# Altium project UCLA-DRS4.PrjPCB
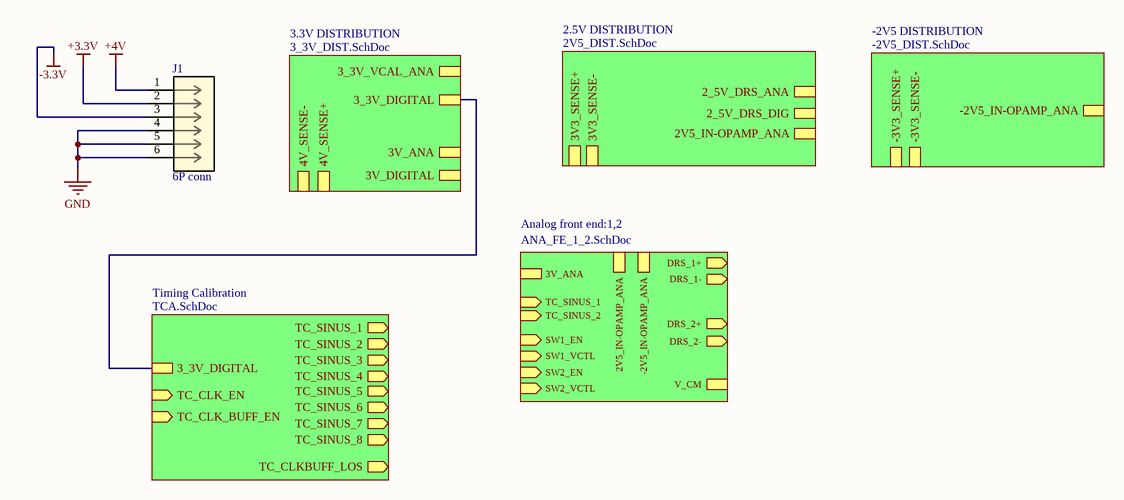
[diagram p0: DRS4-TOP.SchDoc]
6 sheets, 218 parts. Net scope: hierarchical (ports join the sheet entries above them; power ports are global).
Board file: DRS4-PCB.PcbDoc
Sheets:
  DRS4-TOP.SchDoc
    3.3V DISTRIBUTION = 3_3V_DIST.SchDoc
    2.5V DISTRIBUTION = 2V5_DIST.SchDoc
    -2V5 DISTRIBUTION = -2V5_DIST.SchDoc
    Timing Calibration = TCA.SchDoc
    Analog front end:1,2 = ANA_FE_1_2.SchDoc

## Sheet DRS4-TOP.SchDoc: UCLA-DRS4
size Letter; Organization: University of California; Address1: 475 Portola Plaza; Address2: Los Angeles, CA 90095; Revision: R01; SheetNumber: 1; SheetTotal: 1

### Parts
J1  6P conn  [CONN_1586041-6_T]

### Sub-sheets
2.5V DISTRIBUTION = 2V5_DIST.SchDoc: 2_5V_DRS_ANA, 2_5V_DRS_DIG, 3V3_SENSE+, 3V3_SENSE-, 2V5_IN-OPAMP_ANA
3.3V DISTRIBUTION = 3_3V_DIST.SchDoc: 4V_SENSE+, 4V_SENSE-, 3_3V_VCAL_ANA, 3_3V_DIGITAL, 3V_ANA, 3V_DIGITAL
-2V5 DISTRIBUTION = -2V5_DIST.SchDoc: -3V3_SENSE+, -3V3_SENSE-, -2V5_IN-OPAMP_ANA
Analog front end:1,2 = ANA_FE_1_2.SchDoc: SW1_VCTL (in), TC_SINUS_1 (in), TC_SINUS_2 (in), 3V_ANA, SW1_EN (in), 2V5_IN-OPAMP_ANA, -2V5_IN-OPAMP_ANA, DRS_1+ (out), DRS_2+ (out), DRS_1- (out), DRS_2- (out), V_CM, SW2_EN (in), SW2_VCTL (in)
Timing Calibration = TCA.SchDoc: 3_3V_DIGITAL, TC_CLK_EN (in), TC_CLKBUFF_LOS (out), TC_CLK_BUFF_EN (in), TC_SINUS_1 (out), TC_SINUS_2 (out), TC_SINUS_3 (out), TC_SINUS_4 (out), TC_SINUS_5 (out), TC_SINUS_6 (out), TC_SINUS_7 (out), TC_SINUS_8 (out)

### Nets
+3.3V: J1.2
+4V: J1.1
-3.3V: J1.3
GND: J1.4 J1.5 J1.6
NetC6_2: sheet 3.3V DISTRIBUTION/3_3V_DIGITAL, sheet Timing Calibration/3_3V_DIGITAL

### Notes on the sheet
- 475 Portola Plaza
- GAPS TOF
- Title
- igarcia91@g.ucla.edu
- Los Angeles, CA
- 310-825-0344
- Size:
- Date:
- Letter
- Number:
- Time:
- Sheet
- Revision:
- of
- andrew.peck@cern.ch
- spq@ucla.edu
- File:

### Library data of the parts
J1 = 1586041-6: Headers & Wire Housings RA HDR W/O PEGS 6P; Vendor: TE Connectivity; Built_By: EMA_UL_Team; C: Copyright (C) 2015 Accelerated Designs. All rights reserved; Manufacturer_Part_Number: 1586041-6; Copyright: Copyright (C) 2016 Accelerated Designs. All rights reserved; RefDes: RefDes; Type: DEV; Value: Value

## Sheet 3_3V_DIST.SchDoc: 3.3V Distribution
size Letter; Organization: University of California; Address1: 475 Portola Plaza; Address2: Los Angeles, CA 90095; Revision: R01; SheetNumber: 1; SheetTotal: 1
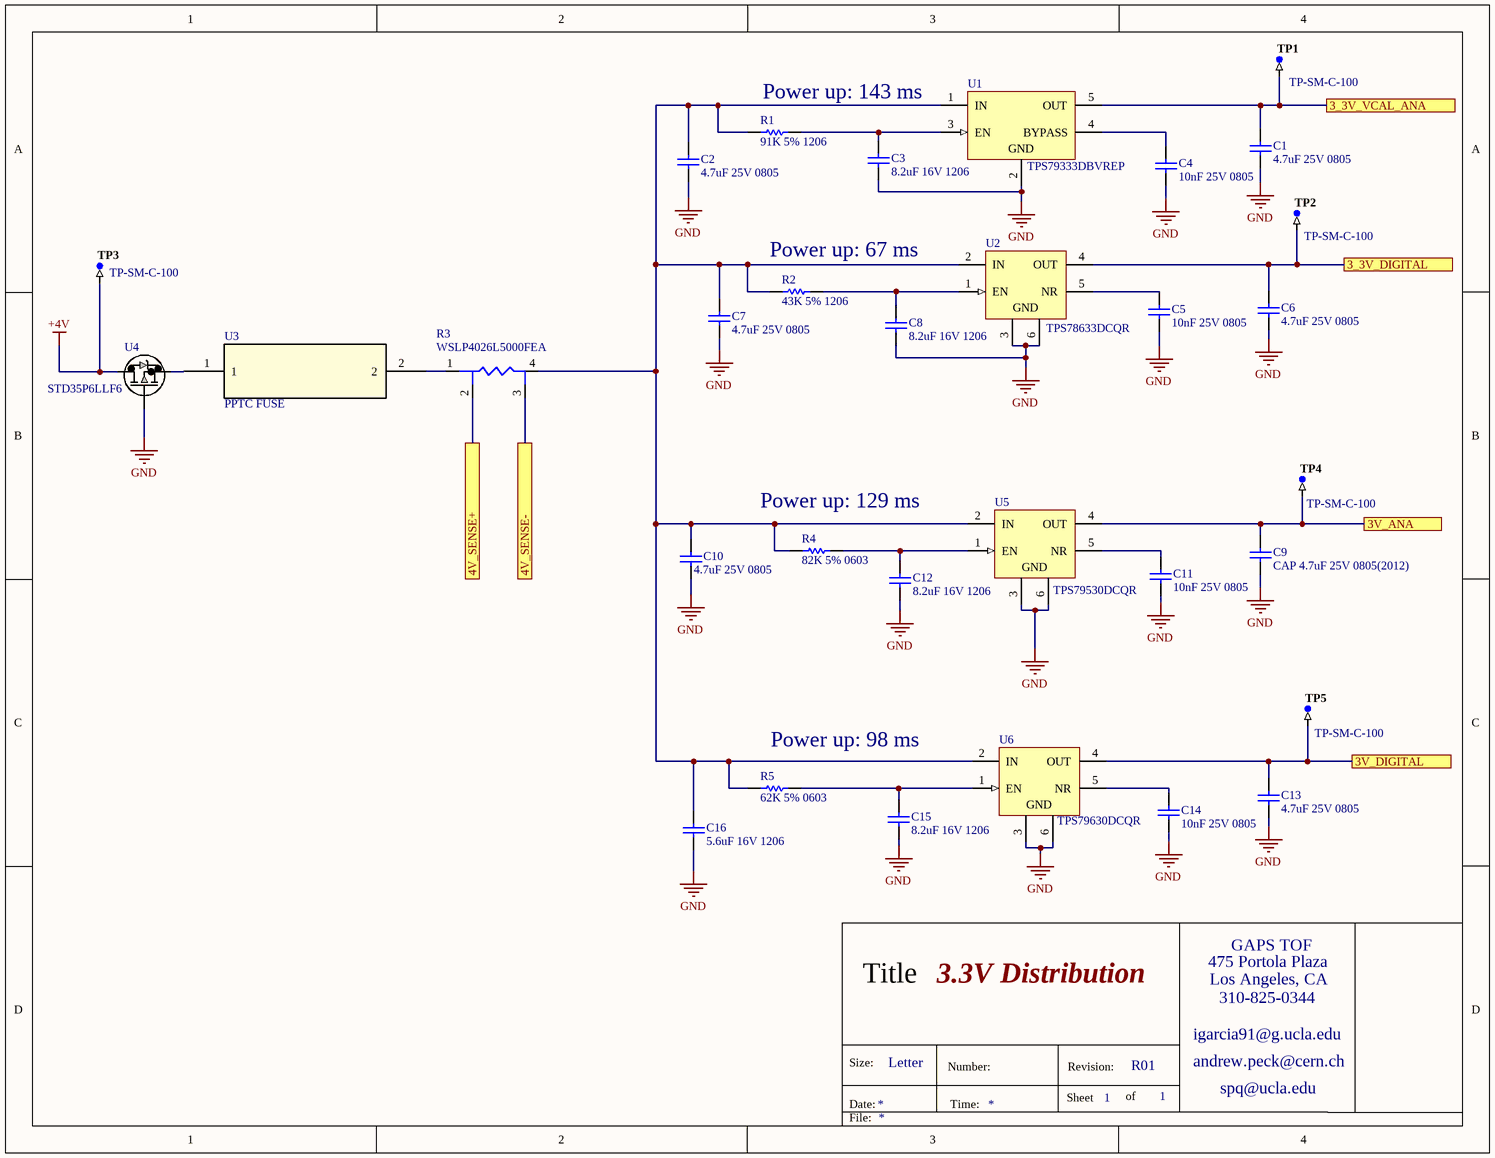
[diagram p1: 3_3V_DIST.SchDoc]

### Parts
C1  4.7uF 25V 0805  [CAPC0805(2012)145_L]
C2  4.7uF 25V 0805  [CAPC0805(2012)145_L]
C3  8.2uF 16V 1206  [CAPC1206(3216)190_N]
C4  10nF 25V 0805  [CAPC0805(2012)145_M]
C5  10nF 25V 0805  [CAPC0805(2012)145_M]
C6  4.7uF 25V 0805  [CAPC0805(2012)145_L]
C7  4.7uF 25V 0805  [CAPC0805(2012)145_L]
C8  8.2uF 16V 1206  [CAPC1206(3216)190_N]
C9  CAP 4.7uF 25V 0805(2012)  [CAPC0805(2012)145_L]
C10  4.7uF 25V 0805  [CAPC0805(2012)145_L]
C11  10nF 25V 0805  [CAPC0805(2012)145_M]
C12  8.2uF 16V 1206  [CAPC1206(3216)190_N]
C13  4.7uF 25V 0805  [CAPC0805(2012)145_L]
C14  10nF 25V 0805  [CAPC0805(2012)145_M]
C15  8.2uF 16V 1206  [CAPC1206(3216)190_N]
C16  5.6uF 16V 1206  [CAPC1206(3216)190_N]
R1  91K 5% 1206  [RESC1206(3216)_M]
R2  43K 5% 1206  [RESC1206(3216)_N]
R3  WSLP4026L5000FEA
R4  82K 5% 0603  [RESC0603(1608)_M]
R5  62K 5% 0603  [RESC0603(1608)_L]
TP1  TP-SM-C-100  [TP-SM-C-100]  (no BOM)
TP2  TP-SM-C-100  [TP-SM-C-100]  (no BOM)
TP3  TP-SM-C-100  [TP-SM-C-100]  (no BOM)
TP4  TP-SM-C-100  [TP-SM-C-100]  (no BOM)
TP5  TP-SM-C-100  [TP-SM-C-100]  (no BOM)
U1  TPS79333DBVREP  [DBV0005A_M]
U2  TPS78633DCQR  [DCQ0006A_L]
U3  PPTC FUSE  [0ZCF]
U4  STD35P6LLF6  [DPAK]
U5  TPS79530DCQR  [DCQ0006A_L]
U6  TPS79630DCQR  [DCQ0006A_L]

### Ports
3_3V_DIGITAL, 3_3V_VCAL_ANA, 3V_ANA, 3V_DIGITAL, 4V_SENSE+, 4V_SENSE-

### Nets
+4V: TP3.1 U4.2(D)
GND: C1.1 C2.1 C3.1 C4.1 C5.1 C6.1 C7.1 C8.1 C9.1 C10.1 C11.1 C12.1 C13.1 C14.1 C15.1 C16.1 U1.2(GND) U2.3(GND) U2.6(GND) U4.1(G) U5.3(GND) U5.6(GND) U6.3(GND) U6.6(GND)
NetC1_2: C1.2 TP1.1 U1.5(OUT) ; port 3_3V_VCAL_ANA
NetC2_2: C2.2 C7.2 C10.2 C16.2 R1.1 R2.1 R3.4 R4.1 R5.1 U1.1(IN) U2.2(IN) U5.2(IN) U6.2(IN)
NetC3_2: C3.2 R1.2 U1.3(EN)
NetC4_2: C4.2 U1.4(BYPASS)
NetC5_2: C5.2 U2.5(NR)
NetC6_2: C6.2 TP2.1 U2.4(OUT) ; port 3_3V_DIGITAL
NetC8_2: C8.2 R2.2 U2.1(EN)
NetC9_2: C9.2 TP4.1 U5.4(OUT) ; port 3V_ANA
NetC11_2: C11.2 U5.5(NR)
NetC12_2: C12.2 R4.2 U5.1(EN)
NetC13_2: C13.2 TP5.1 U6.4(OUT) ; port 3V_DIGITAL
NetC14_2: C14.2 U6.5(NR)
NetC15_2: C15.2 R5.2 U6.1(EN)
NetR3_1: R3.1 U3.2
NetR3_2: R3.2 ; port 4V_SENSE+
NetR3_3: R3.3 ; port 4V_SENSE-
NetU3_1: U3.1 U4.3(S)

### Notes on the sheet
- Power up: 143 ms
- (near R2) Power up: 67 ms
- (near R4) Power up: 129 ms
- (near R5) Power up: 98 ms
- 475 Portola Plaza
- GAPS TOF
- Title
- igarcia91@g.ucla.edu
- Los Angeles, CA
- 310-825-0344
- Size:
- Date:
- Letter
- Number:
- Time:
- Sheet
- Revision:
- of
- andrew.peck@cern.ch
- spq@ucla.edu
- File:

### Library data of the parts
C1 C2 C6 C7 C9 C10 C13 = CMP-1036-04895-1: CAP 4.7uF 25V ±10% 0805 (2012 Metric) Thickness 1.45mm SMD; Case-Metric: 2012; Case-EIA: 0805; Tolerance: Â±10%; Value: 4.7uF; Technology: SMT; Rated Voltage: 25 V; Max Thickness: 1.45 mm
C3 C8 C12 C15 = CMP-1037-04959-1: CAP 8.2uF 16V ±20% 1206 (3216 Metric) Thickness 1.9mm SMD; Case-EIA: 1206; Case-Metric: 3216; Tolerance: Â±20%; Technology: SMT; Max Thickness: 1.9 mm; Value: 8.2uF; Rated Voltage: 16 V
C4 C5 C11 C14 = CMP-1036-03831-1: CAP 10nF 25V ±10% 0805 (2012 Metric) Thickness 1.45mm SMD; Case-EIA: 0805; Case-Metric: 2012; Tolerance: Â±10%; Value: 10nF; Max Thickness: 1.45 mm; Technology: SMT; Rated Voltage: 25 V
C16 = CMP-1037-04932-1: CAP 5.6uF 16V ±10% 1206 (3216 Metric) Thickness 1.9mm SMD; Tolerance: Â±10%; Case-Metric: 3216; Case-EIA: 1206; Technology: SMT; Rated Voltage: 16 V; Value: 5.6uF; Max Thickness: 1.9 mm
R1 = CMP-1014-00121-1: 91K 0.25W 5% 1206 (3216 Metric)  SMD; Value: 91000.00 Ohm; Case-Metric: 3216; Case-EIA: 1206; Tolerance: 5 %; Power: 0.25 W; Technology: SMT
R2 = CMP-1014-00113-1: 43K 0.25W 5% 1206 (3216 Metric)  SMD; Case-EIA: 1206; Case-Metric: 3216; Value: 43000.00 Ohm; Tolerance: 5 %; Technology: SMT; Power: 0.25 W
R3 = WSLP4026L5000FEA: Current Sense Resistors - SMD 7watt .0005ohm 1%
R4 = CMP-1012-00120-1: 82K 0.1W 5% 0603 (1608 Metric)  SMD; Case-Metric: 1608; Case-EIA: 0603; Value: 82000.00 Ohm; Technology: SMT; Tolerance: 5 %; Power: 0.1 W
R5 = CMP-1012-00117-1: 62K 0.1W 5% 0603 (1608 Metric)  SMD; Value: 62000.00 Ohm; Case-Metric: 1608; Case-EIA: 0603; Technology: SMT; Power: 0.1 W; Tolerance: 5 %
TP1-TP5 = CMP-0484-00002-2: Test Point, Surface Mount, Circular, Pad Diameter 1 mm; Manufacturer: No Vendor; PartNumber: TP-SM-C-100
U1 = CMP-0394-00316-2: Single Output Fast RF LDO, 200 mA, Fixed 3.3 V Output, 2.7 to 5.5 V Input, 5-pin SOT-23 (DBV), -40 to 125 degC, Green (RoHS & no Sb/Br); Manufacturer: Texas Instruments; Accuracy(%): 2; SubFamily: Single Channel LDO; Vin(Max)(V): 5.5; Fixed Output Options(V): 3.3; Vdo(Typ)(mV): 102; Iout(Max)(A): 0.2; Rating: HiRel Enhanced Product; Vin(Min)(V): 2.7; DatasheetVersion: SGLS163B; PackageVersion: 4073253-4/K; Code_JEDEC: MO-178; PackageDescription: 5-Pin Plastic Small Outline, Body 1.60 Ãƒâ€” 2.90 mm, Pitch 0.95 mm; ComponentLink1Description: Manufacturer URL; ComponentLink1URL: http://www.ti.com/; ComponentLink2Description: Datasheet; ComponentLink2URL: http://www.ti.com/general/docs/lit/getliterature.tsp?genericPartNumber=TPS79333-EP&fileType=pdf; ComponentLink3URL: http://www.ti.com/litv/pdf/mpds018i; Mounting Technology: Surface Mount; PartNumber: TPS79333DBVREP; Vout Adj(Min)(V): 3.3; PackageReference: DBV0005A; Iq(Typ)(mA): 0.2; Vout Adj(Max)(V): 3.3; Eco-Plan: Green (RoHS & no Sb/Br); ComponentLink3Description: Package Specification
U2 = CMP-0395-00353-2: Single Output High PSRR LDO, 1.5 A, Fixed 3.3 V Output, 2.7 to 5.5 V Input, 6-pin SOT-223 (DCQ), -40 to 125 degC, Green (RoHS & no Sb/Br); Manufacturer: Texas Instruments; Vdo(Typ)(mV): 340; Iq(Typ)(mA): 0.02; Fixed Output Options(V): 3.3; Iout(Max)(A): 1.5; Accuracy(%): 3; SubFamily: Single Channel LDO; Vin(Max)(V): 5.5; Vin(Min)(V): 2.7; ComponentLink2URL: http://www.ti.com/general/docs/lit/getliterature.tsp?genericPartNumber=TPS78633&fileType=pdf; PackageDescription: 6-Pin Plastic Small Outline, Body 3.5 x 6.5 mm, Pitch 1.27 mm; Eco-Plan: Green (RoHS & no Sb/Br); ComponentLink2Description: Datasheet; ComponentLink1URL: http://www.ti.com/; Mounting Technology: Surface Mount; Vout Adj(Min)(V): 3.3; ComponentLink1Description: Manufacturer URL; PackageReference: DCQ0006A; ComponentLink3URL: http://www.ti.com/litv/pdf/mpds098c; PackageVersion: 4202109/D; ComponentLink3Description: Package Specification; PartNumber: TPS78633DCQR; Vout Adj(Max)(V): 3.3; DatasheetVersion: SLVS389L
U3 = 0ZCF0250FF2C: Resettable Fuses - PPTC; Vendor: Belfuse; Built_By: EMA_UL_Team; C: Copyright (C) 2016 Accelerated Designs. All rights reserved; Manufacturer_Part_Number: 0ZCF0250FF2C; RefDes: RefDes; Type: DEV; Value: Value
U4 = STD35P6LLF6: MOSFET P-channel 60 V, 0.025 Ohm typ., 35 A STripFET F6 Power MOSFET in a DPAK package; Manufacturer_Part_Number: STD35NF06T4; Vendor: STMicroelectronics; Built_By: EMA_UL_Team; C: Copyright (C) 2015 Accelerated Designs. All rights reserved; RefDes: RefDes; Type: DEV; Value: Value
U5 = CMP-0395-00302-2: Single Output High PSRR LDO, 500 mA, Fixed 3 V Output, 2.7 to 5.5 V Input, 6-pin SOT-223 (DCQ), -40 to 125 degC, Green (RoHS & no Sb/Br); Manufacturer: Texas Instruments; Accuracy(%): 2; Fixed Output Options(V): 3; Iq(Typ)(mA): 0.26; Vdo(Typ)(mV): 110; Vin(Min)(V): 2.7; Vin(Max)(V): 5.5; Iout(Max)(A): 0.5; Rating: Catalog; SubFamily: Single Channel LDO; ComponentLink2URL: http://www.ti.com/general/docs/lit/getliterature.tsp?genericPartNumber=TPS79530&fileType=pdf; PackageDescription: 6-Pin Plastic Small Outline, Body 3.5 x 6.5 mm, Pitch 1.27 mm; Mounting Technology: Surface Mount; ComponentLink1URL: http://www.ti.com/; ComponentLink3URL: http://www.ti.com/litv/pdf/mpds098c; DatasheetVersion: SLVS350H; Vout Adj(Max)(V): 3; PackageVersion: 4202109/D; ComponentLink2Description: Datasheet; Vout Adj(Min)(V): 3; Eco-Plan: Green (RoHS & no Sb/Br); PartNumber: TPS79530DCQR; ComponentLink3Description: Package Specification; ComponentLink1Description: Manufacturer URL; PackageReference: DCQ0006A
U6 = CMP-0395-00336-2: Single Output High PSRR LDO, 1 A, Fixed 3 V Output, 2.7 to 5.5 V Input, 6-pin SOT-223 (DCQ), -40 to 125 degC, Green (RoHS & no Sb/Br); Manufacturer: Texas Instruments; Fixed Output Options(V): 3; Vdo(Typ)(mV): 250; Iout(Max)(A): 1; Vin(Min)(V): 2.7; SubFamily: Single Channel LDO; Accuracy(%): 2; Vin(Max)(V): 5.5; Iq(Typ)(mA): 0.26; ComponentLink1URL: http://www.ti.com/; ComponentLink1Description: Manufacturer URL; ComponentLink3URL: http://www.ti.com/litv/pdf/mpds098c; Mounting Technology: Surface Mount; Vout Adj(Max)(V): 3; Vout Adj(Min)(V): 3; ComponentLink2Description: Datasheet; ComponentLink3Description: Package Specification; DatasheetVersion: SLVS351N; PackageVersion: 4202109/D; ComponentLink2URL: http://www.ti.com/general/docs/lit/getliterature.tsp?genericPartNumber=TPS79630&fileType=pdf; Eco-Plan: Green (RoHS & no Sb/Br); PackageReference: DCQ0006A; PackageDescription: 6-Pin Plastic Small Outline, Body 3.5 x 6.5 mm, Pitch 1.27 mm; PartNumber: TPS79630DCQR

## Sheet 2V5_DIST.SchDoc: 2.5V distribution
size Letter; Organization: University of California; Address1: 475 Portola Plaza; Address2: Los Angeles, CA 90095; Revision: R01; SheetNumber: 1; SheetTotal: 1
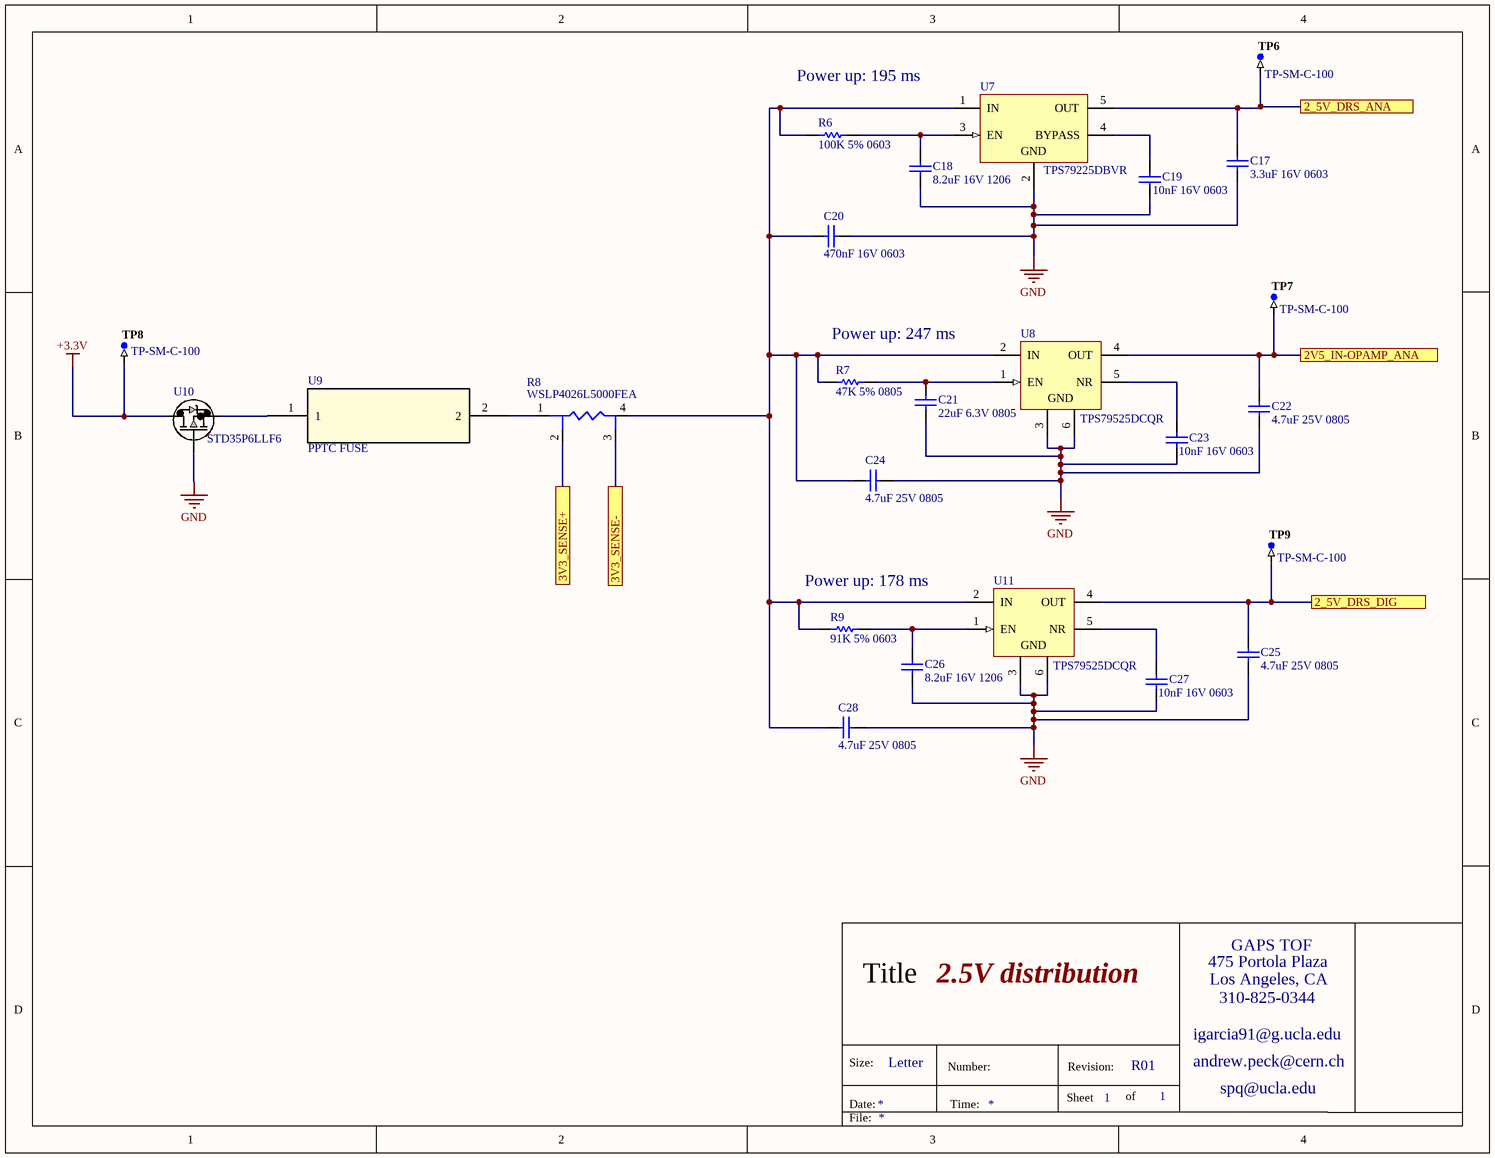
[diagram p2: 2V5_DIST.SchDoc]

### Parts
C17  3.3uF 16V 0603  [CAPC0603(1608)100_L]
C18  8.2uF 16V 1206  [CAPC1206(3216)190_N]
C19  10nF 16V 0603  [CAPC0603(1608)100_L]
C20  470nF 16V 0603  [CAPC0603(1608)100_M]
C21  22uF 6.3V 0805  [CAPC0805(2012)145_M]
C22  4.7uF 25V 0805  [CAPC0805(2012)145_L]
C23  10nF 16V 0603  [CAPC0603(1608)100_L]
C24  4.7uF 25V 0805  [CAPC0805(2012)145_L]
C25  4.7uF 25V 0805  [CAPC0805(2012)145_L]
C26  8.2uF 16V 1206  [CAPC1206(3216)190_N]
C27  10nF 16V 0603  [CAPC0603(1608)100_L]
C28  4.7uF 25V 0805  [CAPC0805(2012)145_L]
R6  100K 5% 0603  [RESC0603(1608)_N]
R7  47K 5% 0805  [RESC0805(2012)_L]
R8  WSLP4026L5000FEA
R9  91K 5% 0603  [RESC0603(1608)_L]
TP6  TP-SM-C-100  [TP-SM-C-100]  (no BOM)
TP7  TP-SM-C-100  [TP-SM-C-100]  (no BOM)
TP8  TP-SM-C-100  [TP-SM-C-100]  (no BOM)
TP9  TP-SM-C-100  [TP-SM-C-100]  (no BOM)
U7  TPS79225DBVR  [DBV0005A_M]
U8  TPS79525DCQR  [DCQ0006A_L]
U9  PPTC FUSE  [0ZCF]
U10  STD35P6LLF6  [DPAK]
U11  TPS79525DCQR  [DCQ0006A_L]

### Ports
2_5V_DRS_ANA, 2_5V_DRS_DIG, 2V5_IN-OPAMP_ANA, 3V3_SENSE+, 3V3_SENSE-

### Nets
+3.3V: TP8.1 U10.2(D)
GND: C17.1 C18.1 C19.1 C20.1 C21.1 C22.1 C23.1 C24.2 C25.1 C26.1 C27.1 C28.2 U7.2(GND) U8.3(GND) U8.6(GND) U10.1(G) U11.3(GND) U11.6(GND)
NetC17_2: C17.2 TP6.1 U7.5(OUT) ; port 2_5V_DRS_ANA
NetC18_2: C18.2 R6.2 U7.3(EN)
NetC19_2: C19.2 U7.4(BYPASS)
NetC20_2: C20.2 C24.1 C28.1 R6.1 R7.1 R8.4 R9.1 U7.1(IN) U8.2(IN) U11.2(IN)
NetC21_2: C21.2 R7.2 U8.1(EN)
NetC22_2: C22.2 TP7.1 U8.4(OUT) ; port 2V5_IN-OPAMP_ANA
NetC23_2: C23.2 U8.5(NR)
NetC25_2: C25.2 TP9.1 U11.4(OUT) ; port 2_5V_DRS_DIG
NetC26_2: C26.2 R9.2 U11.1(EN)
NetC27_2: C27.2 U11.5(NR)
NetR8_1: R8.1 U9.2
NetR8_2: R8.2 ; port 3V3_SENSE+
NetR8_3: R8.3 ; port 3V3_SENSE-
NetU9_1: U9.1 U10.3(S)

### Notes on the sheet
- Power up: 195 ms
- Power up: 247 ms
- Power up: 178 ms
- 475 Portola Plaza
- GAPS TOF
- Title
- igarcia91@g.ucla.edu
- Los Angeles, CA
- 310-825-0344
- Size:
- Date:
- Letter
- Number:
- Time:
- Sheet
- Revision:
- of
- andrew.peck@cern.ch
- spq@ucla.edu
- File:

### Library data of the parts
C17 = CMP-1035-02774-1: CAP 3.3uF 16V ±20% 0603 (1608 Metric) Thickness 1mm SMD; Case-Metric: 1608; Tolerance: Â±20%; Case-EIA: 0603; Technology: SMT; Rated Voltage: 16 V; Max Thickness: 1 mm; Value: 3.3uF
C18 C26 = CMP-1037-04959-1: as C3 on sheet 3_3V_DIST; Technology: SMT; Max Thickness: 1.9 mm; Value: 8.2uF; Rated Voltage: 16 V
C19 C23 C27 = CMP-1035-02311-1: CAP 10nF 16V ±10% 0603 (1608 Metric) Thickness 1mm SMD; Case-EIA: 0603; Case-Metric: 1608; Tolerance: Â±10%; Rated Voltage: 16 V; Value: 10nF; Max Thickness: 1 mm; Technology: SMT
C20 = CMP-1035-02700-1: CAP 470nF 16V ±10% 0603 (1608 Metric) Thickness 1mm SMD; Tolerance: Â±10%; Case-EIA: 0603; Case-Metric: 1608; Technology: SMT; Max Thickness: 1 mm; Value: 470nF; Rated Voltage: 16 V
C21 = CMP-1036-04939-1: CAP 22uF 6.3V ±20% 0805 (2012 Metric) Thickness 1.45mm SMD; Case-EIA: 0805; Tolerance: Â±20%; Case-Metric: 2012; Max Thickness: 1.45 mm; Technology: SMT; Rated Voltage: 6.3 V; Value: 22uF
C22 C24 C25 C28 = CMP-1036-04895-1: as C1 on sheet 3_3V_DIST; Value: 4.7uF; Technology: SMT; Rated Voltage: 25 V; Max Thickness: 1.45 mm
R6 = CMP-1012-00122-1: 100K 0.1W 5% 0603 (1608 Metric)  SMD; Case-EIA: 0603; Value: 100000.00 Ohm; Case-Metric: 1608; Tolerance: 5 %; Power: 0.1 W; Technology: SMT
R7 = CMP-1013-00114-1: 47K 0.125W 5% 0805 (2012 Metric)  SMD; Case-Metric: 2012; Case-EIA: 0805; Value: 47000.00 Ohm; Tolerance: 5 %; Power: 0.125 W; Technology: SMT
R8 = WSLP4026L5000FEA: as R3 on sheet 3_3V_DIST
R9 = CMP-1012-00121-1: 91K 0.1W 5% 0603 (1608 Metric)  SMD; Value: 91000.00 Ohm; Case-Metric: 1608; Case-EIA: 0603; Tolerance: 5 %; Power: 0.1 W; Technology: SMT
TP6-TP9 = CMP-0484-00002-2: as TP1 on sheet 3_3V_DIST; PartNumber: TP-SM-C-100
U7 = CMP-0394-00239-2: Single Output High PSRR LDO, 100 mA, Fixed 2.5 V Output, 2.7 to 5.5 V Input, 5-pin SOT-23 (DBV), -40 to 125 degC, Green (RoHS & no Sb/Br); Manufacturer: Texas Instruments; Vdo(Typ)(mV): 55; Vin(Max)(V): 5.5; Vout Adj(Max)(V): 2.5; Vin(Min)(V): 2.7; Accuracy(%): 2; Iout(Max)(A): 0.1; SubFamily: Single Channel LDO; Iq(Typ)(mA): 0.2; Rating: Catalog; ComponentLink4Description: URL Link1; ComponentLink3Description: Package Specification; Mounting Technology: Surface Mount; ComponentLink2URL: http://www.ti.com/general/docs/lit/getliterature.tsp?genericPartNumber=TPS79225&fileType=pdf; ComponentLink1URL: http://www.ti.com/; PackageReference: DBV0005A; ComponentLink3URL: http://www.ti.com/litv/pdf/mpds018i; ComponentLink2Description: Datasheet; Fixed Output Options(V): 2.5; Vout Adj(Min)(V): 2.5; PackageVersion: 4073253-4/K; PartNumber: TPS79225DBVR; Eco-Plan: Green (RoHS & no Sb/Br); DatasheetVersion: SLVS337B; Code_JEDEC: MO-178; ComponentLink4URL: Samples URL:http://www.ti.com/product/tps79225#samples; PackageDescription: 5-Pin Plastic Small Outline, Body 1.60 Ãƒâ€” 2.90 mm, Pitch 0.95 mm; ComponentLink1Description: Manufacturer URL
U8 U11 = CMP-0395-00444-2: Single Output High PSRR LDO, 500 mA, Fixed 2.5 V Output, 2.7 to 5.5 V Input, 6-pin SOT-223 (DCQ), -40 to 125 degC, Green (RoHS & no Sb/Br); Manufacturer: Texas Instruments; Iout(Max)(A): 0.5; Vout Adj(Min)(V): 2.5; Vin(Max)(V): 5.5; SubFamily: Single Channel LDO; Vdo(Typ)(mV): 110; Rating: Catalog; Accuracy(%): 2; Iq(Typ)(mA): 0.26; Vin(Min)(V): 2.7; ComponentLink3URL: http://www.ti.com/litv/pdf/mpds098c; ComponentLink1URL: http://www.ti.com/; Eco-Plan: Green (RoHS & no Sb/Br); PackageDescription: 6-Pin Plastic Small Outline, Body 3.5 x 6.5 mm, Pitch 1.27 mm; PartNumber: TPS79525DCQR; Fixed Output Options(V): 2.5; ComponentLink1Description: Manufacturer URL; PackageReference: DCQ0006A; ComponentLink2Description: Datasheet; Vout Adj(Max)(V): 2.5; ComponentLink3Description: Package Specification; ComponentLink2URL: http://www.ti.com/general/docs/lit/getliterature.tsp?genericPartNumber=TPS79525&fileType=pdf; Mounting Technology: Surface Mount; DatasheetVersion: SLVS350H; PackageVersion: 4202109/D
U9 = 0ZCF0250FF2C: as U3 on sheet 3_3V_DIST; Manufacturer_Part_Number: 0ZCF0250FF2C; RefDes: RefDes; Type: DEV; Value: Value
U10 = STD35P6LLF6: as U4 on sheet 3_3V_DIST; RefDes: RefDes; Type: DEV; Value: Value

## Sheet -2V5_DIST.SchDoc: -2.5V Distribution
size Letter; Organization: University of California; Address1: 475 Portola Plaza; Address2: Los Angeles, CA 90095; Revision: R01; SheetNumber: 1; SheetTotal: 1
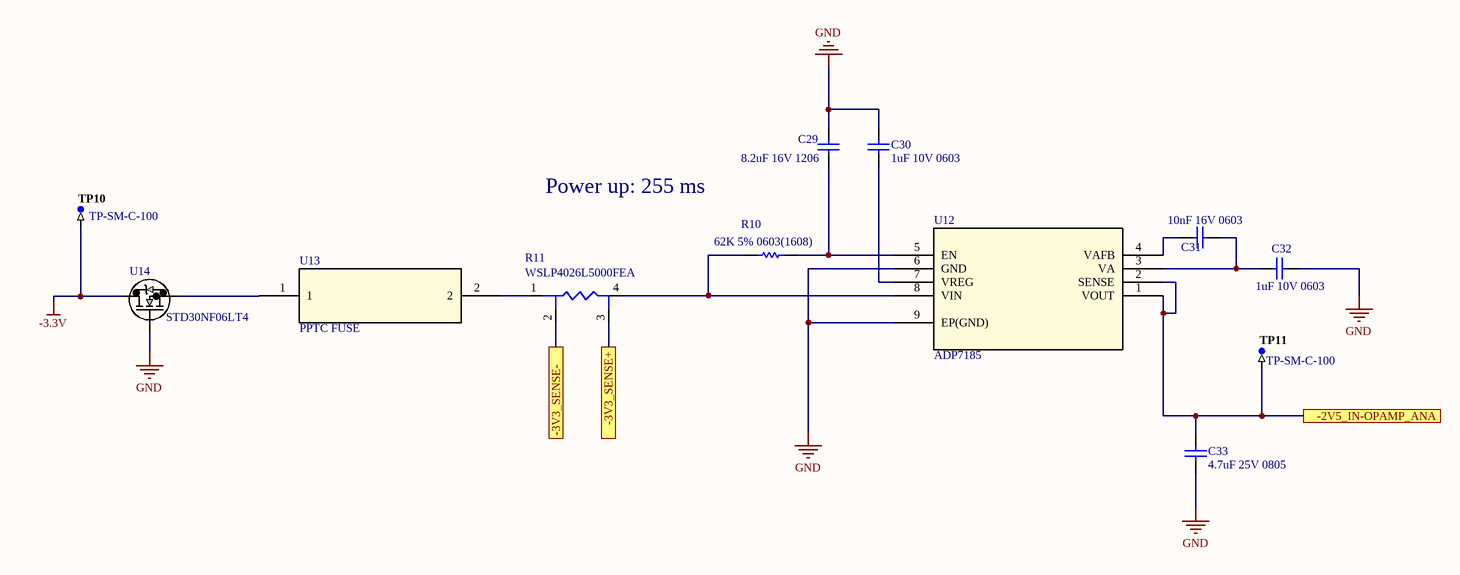
[diagram p3: -2V5_DIST.SchDoc]

### Parts
C29  8.2uF 16V 1206  [CAPC1206(3216)190_N]
C30  1uF 10V 0603  [CAPC0603(1608)100_L]
C31  10nF 16V 0603  [CAPC0603(1608)100_L]
C32  1uF 10V 0603  [CAPC0603(1608)100_L]
C33  4.7uF 25V 0805  [CAPC0805(2012)145_L]
R10  62K 5% 0603(1608)  [RESC0603(1608)_L]
R11  WSLP4026L5000FEA
TP10  TP-SM-C-100  [TP-SM-C-100]  (no BOM)
TP11  TP-SM-C-100  [TP-SM-C-100]  (no BOM)
U12  ADP7185  [CP_8_27]
U13  PPTC FUSE  [0ZCF]
U14  STD30NF06LT4  [DPAK]

### Ports
-2V5_IN-OPAMP_ANA, -3V3_SENSE+, -3V3_SENSE-

### Nets
-3.3V: TP10.1 U14.2(D)
GND: C29.2 C30.2 C32.2 C33.1 U12.6(GND) U12.9(EP(GND)) U14.1(G)
NetC29_1: C29.1 R10.2 U12.5(EN)
NetC30_1: C30.1 U12.7(VREG)
NetC31_1: C31.1 C32.1 U12.3(VA)
NetC31_2: C31.2 U12.4(VAFB)
NetC33_2: C33.2 TP11.1 U12.1(VOUT) U12.2(SENSE) ; port -2V5_IN-OPAMP_ANA
NetR10_1: R10.1 R11.4 U12.8(VIN)
NetR11_1: R11.1 U13.2
NetR11_2: R11.2 ; port -3V3_SENSE-
NetR11_3: R11.3 ; port -3V3_SENSE+
NetU13_1: U13.1 U14.3(S)

### Notes on the sheet
- Power up: 255 ms
- 475 Portola Plaza
- GAPS TOF
- Title
- igarcia91@g.ucla.edu
- Los Angeles, CA
- 310-825-0344
- Size:
- Date:
- Letter
- Number:
- Time:
- Sheet
- Revision:
- of
- andrew.peck@cern.ch
- spq@ucla.edu
- File:

### Library data of the parts
C29 = CMP-1037-04959-1: as C3 on sheet 3_3V_DIST; Technology: SMT; Max Thickness: 1.9 mm; Value: 8.2uF; Rated Voltage: 16 V
C30 C32 = CMP-1035-02734-1: CAP 1uF 10V ±20% 0603 (1608 Metric) Thickness 1mm SMD; Tolerance: Â±20%; Case-EIA: 0603; Case-Metric: 1608; Technology: SMT; Value: 1uF; Max Thickness: 1 mm; Rated Voltage: 10 V
C31 = CMP-1035-02311-1: as C19 on sheet 2V5_DIST; Rated Voltage: 16 V; Value: 10nF; Max Thickness: 1 mm; Technology: SMT
C33 = CMP-1036-04895-1: as C1 on sheet 3_3V_DIST; Value: 4.7uF; Technology: SMT; Rated Voltage: 25 V; Max Thickness: 1.45 mm
R10 = CMP-1012-00117-1: as R5 on sheet 3_3V_DIST; Technology: SMT; Power: 0.1 W; Tolerance: 5 %
R11 = WSLP4026L5000FEA: as R3 on sheet 3_3V_DIST
TP10 TP11 = CMP-0484-00002-2: as TP1 on sheet 3_3V_DIST; PartNumber: TP-SM-C-100
U12 = ADP7185ACPZN1.0-: LDO Voltage Regulators -500mA Ult low noise High Psrr negative; Manufacturer_Part_Number: ADP7185ACPZN1.0-R7; Vendor: Analog Devices Inc; Built_By: Analog Devices Inc.; RefDes: RefDes; Type: DEV; Value: Value
U13 = 0ZCF0250FF2C: as U3 on sheet 3_3V_DIST; Manufacturer_Part_Number: 0ZCF0250FF2C; RefDes: RefDes; Type: DEV; Value: Value
U14 = STD30NF06LT4: MOSFET Automotive-grade N-channel 60 V, 19 mOhm typ., 24 A STripFET F6 Power MOSFET in a DPAK package; Vendor: STMicroelectronics; Built_By: EMA_UL_Team; C: Copyright (C) 2015 Accelerated Designs. All rights reserved; Manufacturer_Part_Number: STD30NF06LT4; RefDes: RefDes; Type: DEV; Value: Value

## Sheet TCA.SchDoc: Timing Calibration
size Letter; Organization: University of California; Address1: 475 Portola Plaza; Address2: Los Angeles, CA 90095; Revision: R01; SheetNumber: 1; SheetTotal: 1
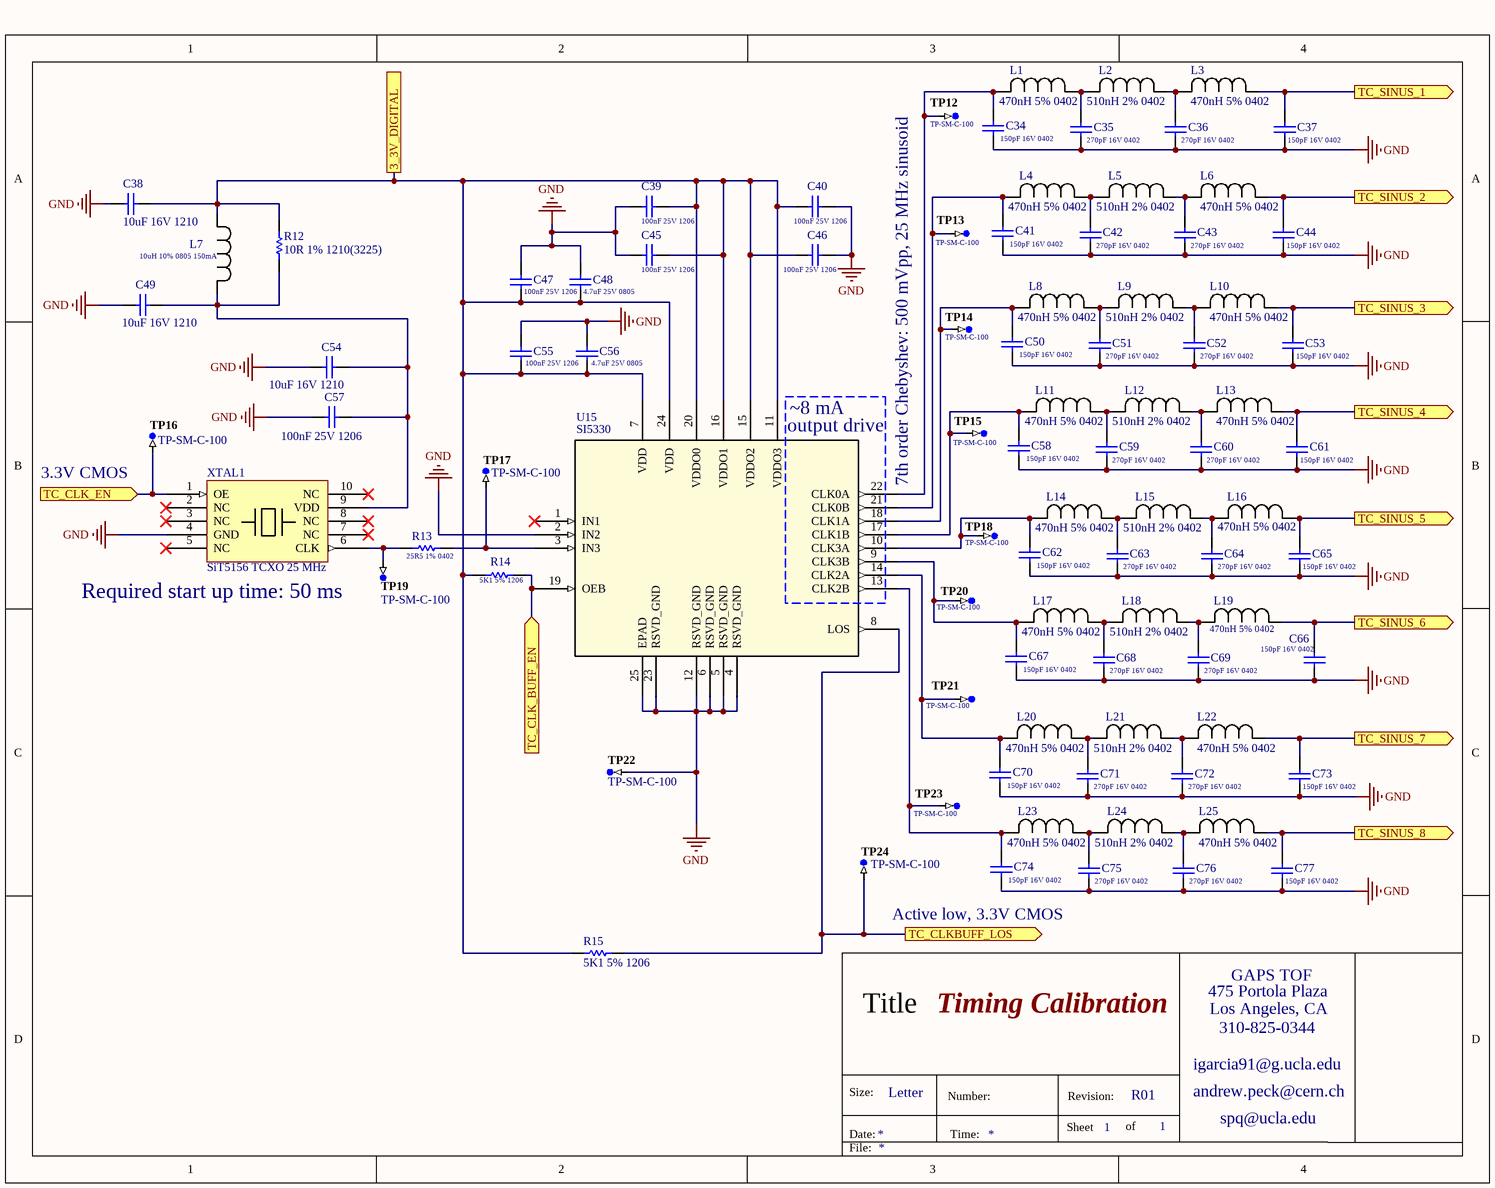
[diagram p4: TCA.SchDoc]

### Parts
C34  150pF 16V 0402  [CAPC0402(1005)60_N]
C35  270pF 16V 0402  [CAPC0402(1005)60_N]
C36  270pF 16V 0402  [CAPC0402(1005)60_N]
C37  150pF 16V 0402  [CAPC0402(1005)60_N]
C38  10uF 16V 1210  [CAPC1210(3225)280_L]
C39  100nF 25V 1206  [CAPC1206(3216)170_M]
C40  100nF 25V 1206  [CAPC1206(3216)170_M]
C41  150pF 16V 0402  [CAPC0402(1005)60_N]
C42  270pF 16V 0402  [CAPC0402(1005)60_N]
C43  270pF 16V 0402  [CAPC0402(1005)60_N]
C44  150pF 16V 0402  [CAPC0402(1005)60_N]
C45  100nF 25V 1206  [CAPC1206(3216)170_M]
C46  100nF 25V 1206  [CAPC1206(3216)170_M]
C47  100nF 25V 1206  [CAPC1206(3216)170_M]
C48  4.7uF 25V 0805  [CAPC0805(2012)145_L]
C49  10uF 16V 1210  [CAPC1210(3225)280_L]
C50  150pF 16V 0402  [CAPC0402(1005)60_N]
C51  270pF 16V 0402  [CAPC0402(1005)60_N]
C52  270pF 16V 0402  [CAPC0402(1005)60_N]
C53  150pF 16V 0402  [CAPC0402(1005)60_N]
C54  10uF 16V 1210  [CAPC1210(3225)280_L]
C55  100nF 25V 1206  [CAPC1206(3216)170_M]
C56  4.7uF 25V 0805  [CAPC0805(2012)145_L]
C57  100nF 25V 1206  [CAPC1206(3216)170_M]
C58  150pF 16V 0402  [CAPC0402(1005)60_N]
C59  270pF 16V 0402  [CAPC0402(1005)60_N]
C60  270pF 16V 0402  [CAPC0402(1005)60_N]
C61  150pF 16V 0402  [CAPC0402(1005)60_N]
C62  150pF 16V 0402  [CAPC0402(1005)60_N]
C63  270pF 16V 0402  [CAPC0402(1005)60_N]
C64  270pF 16V 0402  [CAPC0402(1005)60_N]
C65  150pF 16V 0402  [CAPC0402(1005)60_N]
C66  150pF 16V 0402  [CAPC0402(1005)60_N]
C67  150pF 16V 0402  [CAPC0402(1005)60_N]
C68  270pF 16V 0402  [CAPC0402(1005)60_N]
C69  270pF 16V 0402  [CAPC0402(1005)60_N]
C70  150pF 16V 0402  [CAPC0402(1005)60_N]
C71  270pF 16V 0402  [CAPC0402(1005)60_N]
C72  270pF 16V 0402  [CAPC0402(1005)60_N]
C73  150pF 16V 0402  [CAPC0402(1005)60_N]
C74  150pF 16V 0402  [CAPC0402(1005)60_N]
C75  270pF 16V 0402  [CAPC0402(1005)60_N]
C76  270pF 16V 0402  [CAPC0402(1005)60_N]
C77  150pF 16V 0402  [CAPC0402(1005)60_N]
L1  470nH 5% 0402  [IND_1005]
L2  510nH 2% 0402  [IND_1005]
L3  470nH 5% 0402  [IND_1005]
L4  470nH 5% 0402  [IND_1005]
L5  510nH 2% 0402  [IND_1005]
L6  470nH 5% 0402  [IND_1005]
L7  10uH 10% 0805 150mA  [IND_TAIYO_LBR201]
L8  470nH 5% 0402  [IND_1005]
L9  510nH 2% 0402  [IND_1005]
L10  470nH 5% 0402  [IND_1005]
L11  470nH 5% 0402  [IND_1005]
L12  510nH 2% 0402  [IND_1005]
L13  470nH 5% 0402  [IND_1005]
L14  470nH 5% 0402  [IND_1005]
L15  510nH 2% 0402  [IND_1005]
L16  470nH 5% 0402  [IND_1005]
L17  470nH 5% 0402  [IND_1005]
L18  510nH 2% 0402  [IND_1005]
L19  470nH 5% 0402  [IND_1005]
L20  470nH 5% 0402  [IND_1005]
L21  510nH 2% 0402  [IND_1005]
L22  470nH 5% 0402  [IND_1005]
L23  470nH 5% 0402  [IND_1005]
L24  510nH 2% 0402  [IND_1005]
L25  470nH 5% 0402  [IND_1005]
R12  10R 1% 1210(3225)  [RESC1210(3225)_N]
R13  25R5 1% 0402  [RESC0402(1005)_M]
R14  5K1 5% 1206  [RESC1206(3216)_N]
R15  5K1 5% 1206  [RESC1206(3216)_N]
TP12  TP-SM-C-100  [TP-SM-C-100]  (no BOM)
TP13  TP-SM-C-100  [TP-SM-C-100]  (no BOM)
TP14  TP-SM-C-100  [TP-SM-C-100]  (no BOM)
TP15  TP-SM-C-100  [TP-SM-C-100]  (no BOM)
TP16  TP-SM-C-100  [TP-SM-C-100]  (no BOM)
TP17  TP-SM-C-100  [TP-SM-C-100]  (no BOM)
TP18  TP-SM-C-100  [TP-SM-C-100]  (no BOM)
TP19  TP-SM-C-100  [TP-SM-C-100]  (no BOM)
TP20  TP-SM-C-100  [TP-SM-C-100]  (no BOM)
TP21  TP-SM-C-100  [TP-SM-C-100]  (no BOM)
TP22  TP-SM-C-100  [TP-SM-C-100]  (no BOM)
TP23  TP-SM-C-100  [TP-SM-C-100]  (no BOM)
TP24  TP-SM-C-100  [TP-SM-C-100]  (no BOM)
U15  SI5330  [QFN_24]
XTAL1  SiT5156 TCXO 25 MHz

### Ports
3_3V_DIGITAL, TC_CLK_BUFF_EN (in), TC_CLK_EN (in), TC_CLKBUFF_LOS (out), TC_SINUS_1 (out), TC_SINUS_2 (out), TC_SINUS_3 (out), TC_SINUS_4 (out), TC_SINUS_5 (out), TC_SINUS_6 (out), TC_SINUS_7 (out), TC_SINUS_8 (out)

### Nets
GND: C34.1 C35.1 C36.1 C37.1 C38.1 C39.2 C40.1 C41.1 C42.1 C43.1 C44.1 C45.2 C46.1 C47.2 C48.1 C49.1 C50.1 C51.1 C52.1 C53.1 C54.2 C55.2 C56.1 C57.2 C58.1 C59.1 C60.1 C61.1 C62.1 C63.1 C64.1 C65.1 C66.1 C67.1 C68.1 C69.1 C70.1 C71.1 C72.1 C73.1 C74.1 C75.1 C76.1 C77.1 TP22.1 U15.2(IN2) U15.4(RSVD_GND) U15.5(RSVD_GND) U15.6(RSVD_GND) U15.12(RSVD_GND) U15.23(RSVD_GND) U15.25(EPAD) XTAL1.4(GND)
NetC6_2: C38.2 C39.1 C40.2 C45.1 C46.2 C47.1 C48.2 C55.1 C56.2 L7.2 R12.1 R14.2 R15.2 U15.7(VDD) U15.11(VDDO3) U15.15(VDDO2) U15.16(VDDO1) U15.20(VDDO0) U15.24(VDD) ; port 3_3V_DIGITAL
NetC34_2: C34.2 L1.2 TP12.1 U15.22(CLK0A)
NetC35_2: C35.2 L1.1 L2.2
NetC36_2: C36.2 L2.1 L3.2
NetC37_2: C37.2 L3.1 ; port TC_SINUS_1
NetC41_2: C41.2 L4.2 TP13.1 U15.21(CLK0B)
NetC42_2: C42.2 L4.1 L5.2
NetC43_2: C43.2 L5.1 L6.2
NetC44_2: C44.2 L6.1 ; port TC_SINUS_2
NetC49_2: C49.2 C54.1 C57.1 L7.1 R12.2 XTAL1.9(VDD)
NetC50_2: C50.2 L8.2 TP14.1 U15.18(CLK1A)
NetC51_2: C51.2 L8.1 L9.2
NetC52_2: C52.2 L9.1 L10.2
NetC53_2: C53.2 L10.1 ; port TC_SINUS_3
NetC58_2: C58.2 L11.2 TP15.1 U15.17(CLK1B)
NetC59_2: C59.2 L11.1 L12.2
NetC60_2: C60.2 L12.1 L13.2
NetC61_2: C61.2 L13.1 ; port TC_SINUS_4
NetC62_2: C62.2 L14.2 TP18.1 U15.10(CLK3A)
NetC63_2: C63.2 L14.1 L15.2
NetC64_2: C64.2 L15.1 L16.2
NetC65_2: C65.2 L16.1 ; port TC_SINUS_5
NetC66_2: C66.2 L19.1 ; port TC_SINUS_6
NetC67_2: C67.2 L17.2 TP20.1 U15.9(CLK3B)
NetC68_2: C68.2 L17.1 L18.2
NetC69_2: C69.2 L18.1 L19.2
NetC70_2: C70.2 L20.2 TP21.1 U15.14(CLK2A)
NetC71_2: C71.2 L20.1 L21.2
NetC72_2: C72.2 L21.1 L22.2
NetC73_2: C73.2 L22.1 ; port TC_SINUS_7
NetC74_2: C74.2 L23.2 TP23.1 U15.13(CLK2B)
NetC75_2: C75.2 L23.1 L24.2
NetC76_2: C76.2 L24.1 L25.2
NetC77_2: C77.2 L25.1 ; port TC_SINUS_8
NetR13_1: R13.1 TP19.1 XTAL1.6(CLK)
NetR13_2: R13.2 TP17.1 U15.3(IN3)
NetR14_1: R14.1 U15.19(OEB) ; port TC_CLK_BUFF_EN
NetR15_1: R15.1 TP24.1 U15.8(LOS) ; port TC_CLKBUFF_LOS
NetTP16_1: TP16.1 XTAL1.1(OE) ; port TC_CLK_EN

Not connected (* = marked no-connect by the designer): U15 1(IN1)*; XTAL1 2(NC)* 3(NC)* 5(NC)* 7(NC)* 8(NC)* 10(NC)*

### Notes on the sheet
- (near U15) output drive
- (near U15) ~8 mA
- (near TP16) 3.3V CMOS
- 7th order Chebyshev: 500 mVpp, 25 MHz sinusoid
- (near TP19) Required start up time: 50 ms
- Active low, 3.3V CMOS
- 475 Portola Plaza
- GAPS TOF
- Title
- igarcia91@g.ucla.edu
- Los Angeles, CA
- 310-825-0344
- Size:
- Date:
- Letter
- Number:
- Time:
- Sheet
- Revision:
- of
- andrew.peck@cern.ch
- spq@ucla.edu
- File:

### Library data of the parts
C34 C37 C41 C44 C50 C53 C58 C61 C62 C65-C67 C70 C73 C74 C77 = CMP-1034-01297-1: CAP 150pF 16V ±10% 0402 (1005 Metric) Thickness 0.6mm SMD; Tolerance: Â±10%; Case-Metric: 1005; Case-EIA: 0402; Technology: SMT; Value: 150pF; Rated Voltage: 16 V; Max Thickness: 0.6 mm
C35 C36 C42 C43 C51 C52 C59 C60 C63 C64 C68 C69 C71 C72 C75 C76 = CMP-1034-01392-1: CAP 270pF 16V ±10% 0402 (1005 Metric) Thickness 0.6mm SMD; Tolerance: Â±10%; Case-Metric: 1005; Case-EIA: 0402; Max Thickness: 0.6 mm; Rated Voltage: 16 V; Value: 270pF; Technology: SMT
C38 C49 C54 = CMP-1038-02212-1: CAP 10uF 16V ±10% 1210 (3225 Metric) Thickness 2.8mm SMD; Case-Metric: 3225; Tolerance: Â±10%; Case-EIA: 1210; Technology: SMT; Rated Voltage: 16 V; Max Thickness: 2.8 mm; Value: 10uF
C39 C40 C45-C47 C55 C57 = CMP-1037-04191-1: CAP 100nF 25V ±10% 1206 (3216 Metric) Thickness 1.7mm SMD; Case-Metric: 3216; Tolerance: Â±10%; Case-EIA: 1206; Technology: SMT; Rated Voltage: 25 V; Value: 100nF; Max Thickness: 1.7 mm
C48 C56 = CMP-1036-04895-1: as C1 on sheet 3_3V_DIST; Value: 4.7uF; Technology: SMT; Rated Voltage: 25 V; Max Thickness: 1.45 mm
L1 L3 L4 L6 L8 L10 L11 L13 L14 L16 L17 L19 L20 L22 L23 L25 = MLF1005VR47JT000: Fixed Inductors 470nH 5% 0.12 A 1.5 Ohms; Vendor: TDK; Built_By: EMA_UL_Team; Type: DEV; C: Copyright (C) 2015 Accelerated Designs. All rights reserved; Manufacturer_Part_Number: MLF1005VR47JT000; RefDes: RefDes; Value: Value
L2 L5 L9 L12 L15 L18 L21 L24 = MHQ1005P10NGTD25: Fixed Inductors 0402 510nH 2% 70mA 10.2ohms; Vendor: TDK; Built_By: EMA_UL_Team; Type: DEV; C: Copyright (C) 2015 Accelerated Designs. All rights reserved; Manufacturer_Part_Number: MHQ1005P10NGTD25; RefDes: RefDes; Value: Value
L7 = LBR2012T100K: Fixed Inductors 0805 10uH 468mOhms +/-10%Tol 150mA; Vendor: TAIYO YUDEN; Built_By: EMA_UL_Team; Type: DEV; C: Copyright (C) 2015 Accelerated Designs. All rights reserved; Manufacturer_Part_Number: LBR2012T100K; RefDes: RefDes; Value: Value
R12 = CMP-1015-00284-1: 10R 0.5W 1% 1210 (3225 Metric)  SMD; Value: 10.00 Ohm; Case-Metric: 3225; Case-EIA: 1210; Technology: SMT; Power: 0.5 W; Tolerance: 1 %
R13 = CMP-1011-00328-1: 25R5 0.063W 1% 0402 (1005 Metric)  SMD; Case-EIA: 0402; Case-Metric: 1005; Value: 25.50 Ohm; Tolerance: 1 %; Power: 0.063 W; Technology: SMT
R14 R15 = CMP-1014-00091-1: 5K1 0.25W 5% 1206 (3216 Metric)  SMD; Case-EIA: 1206; Value: 5100.00 Ohm; Case-Metric: 3216; Technology: SMT; Power: 0.25 W; Tolerance: 5 %
TP12-TP24 = CMP-0484-00002-2: as TP1 on sheet 3_3V_DIST; PartNumber: TP-SM-C-100
U15 = SI5330: Imported; Vendor: SILICONLABS; Manufacturer_Part_Number: si5330; RefDes: RefDes; Type: DEV; Value: Value
XTAL1 = SiT5156: Crystal oscillator

## Sheet ANA_FE_1_2.SchDoc: Analog FE:1,2
size Letter; Organization: University of California; Address1: 475 Portola Plaza; Address2: Los Angeles, CA 90095; Revision: R01; SheetNumber: 1; SheetTotal: 1
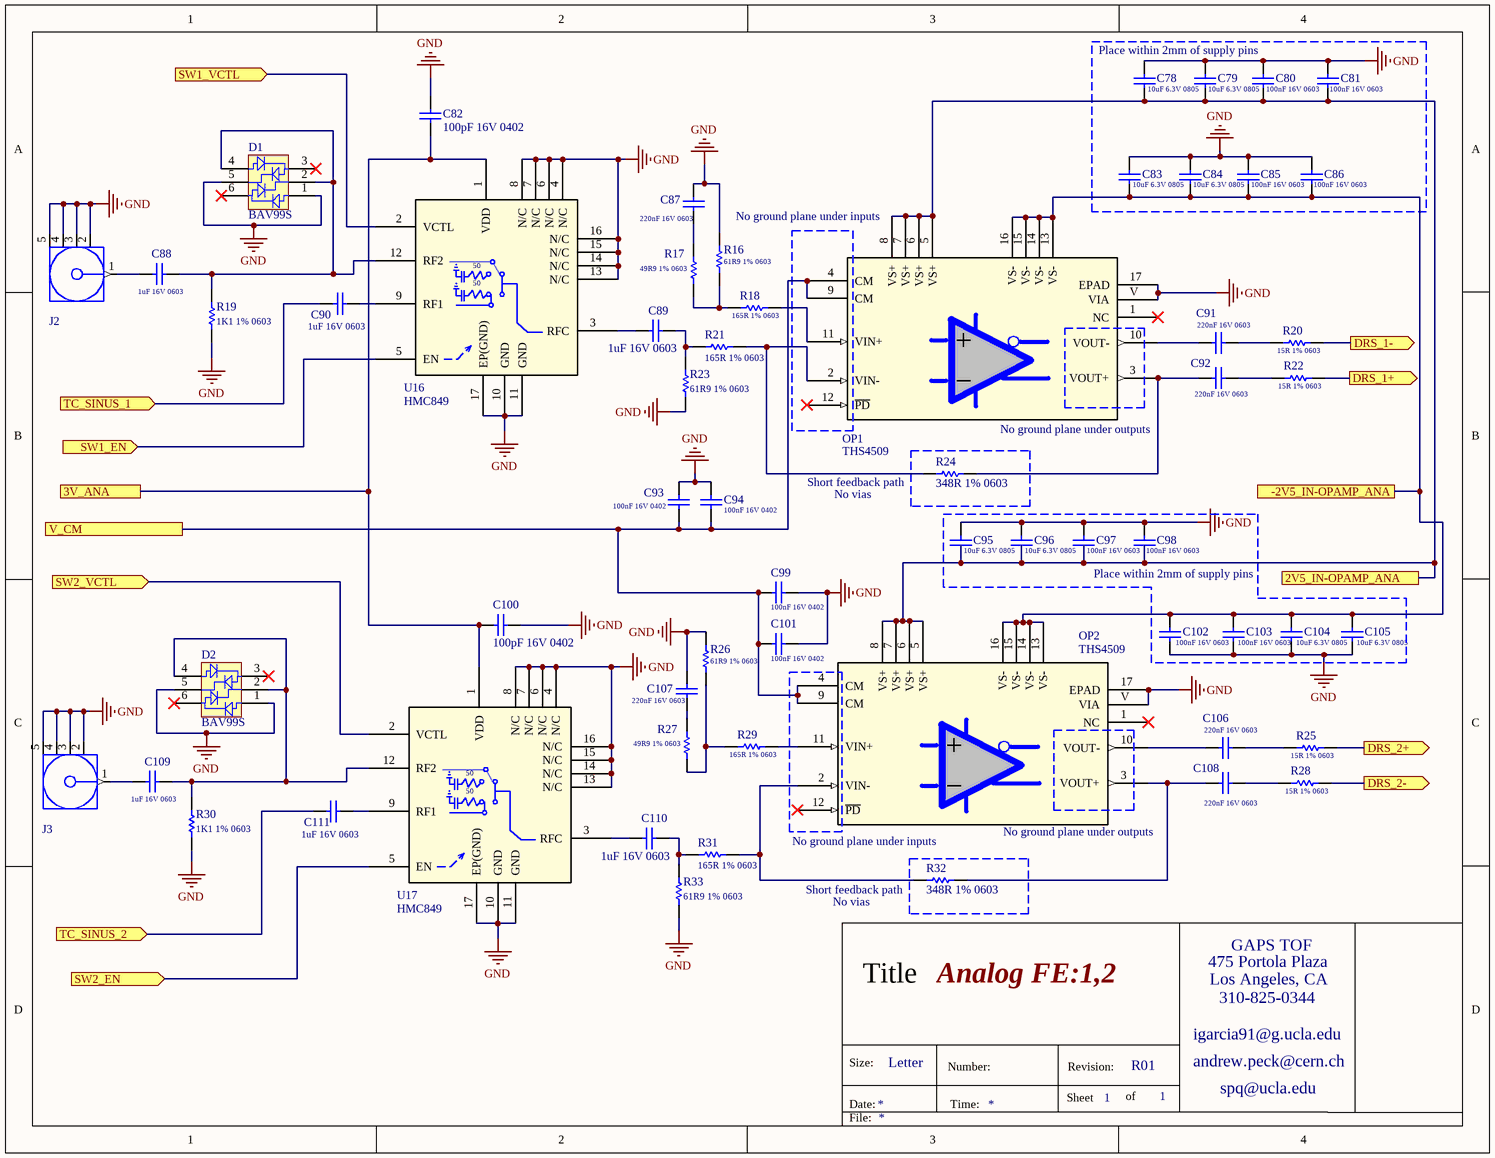
[diagram p5: ANA_FE_1_2.SchDoc]

### Parts
C78  10uF 6.3V 0805  [CAPC0805(2012)145_L]
C79  10uF 6.3V 0805  [CAPC0805(2012)145_L]
C80  100nF 16V 0603  [CAPC0603(1608)100_N]
C81  100nF 16V 0603  [CAPC0603(1608)100_N]
C82  100pF 16V 0402  [CAPC0402(1005)60_M]
C83  10uF 6.3V 0805  [CAPC0805(2012)145_L]
C84  10uF 6.3V 0805  [CAPC0805(2012)145_L]
C85  100nF 16V 0603  [CAPC0603(1608)100_N]
C86  100nF 16V 0603  [CAPC0603(1608)100_N]
C87  220nF 16V 0603  [CAPC0603(1608)100_M]
C88  1uF 16V 0603  [CAPC0603(1608)100_N]
C89  1uF 16V 0603  [CAPC0603(1608)100_N]
C90  1uF 16V 0603  [CAPC0603(1608)100_N]
C91  220nF 16V 0603  [CAPC0603(1608)100_M]
C92  220nF 16V 0603  [CAPC0603(1608)100_M]
C93  100nF 16V 0402  [CAPC0402(1005)60_M]
C94  100nF 16V 0402  [CAPC0402(1005)60_M]
C95  10uF 6.3V 0805  [CAPC0805(2012)145_L]
C96  10uF 6.3V 0805  [CAPC0805(2012)145_L]
C97  100nF 16V 0603  [CAPC0603(1608)100_N]
C98  100nF 16V 0603  [CAPC0603(1608)100_N]
C99  100nF 16V 0402  [CAPC0402(1005)60_M]
C100  100pF 16V 0402  [CAPC0402(1005)60_M]
C101  100nF 16V 0402  [CAPC0402(1005)60_M]
C102  100nF 16V 0603  [CAPC0603(1608)100_N]
C103  100nF 16V 0603  [CAPC0603(1608)100_N]
C104  10uF 6.3V 0805  [CAPC0805(2012)145_L]
C105  10uF 6.3V 0805  [CAPC0805(2012)145_L]
C106  220nF 16V 0603  [CAPC0603(1608)100_M]
C107  220nF 16V 0603  [CAPC0603(1608)100_M]
C108  220nF 16V 0603  [CAPC0603(1608)100_M]
C109  1uF 16V 0603  [CAPC0603(1608)100_N]
C110  1uF 16V 0603  [CAPC0603(1608)100_N]
C111  1uF 16V 0603  [CAPC0603(1608)100_N]
D1  BAV99S  [INF-SOT363_V]
D2  BAV99S  [INF-SOT363_V]
J2  CONREVSMA003.062  [CON-SMA-EDGE062]  (value not drawn)
J3  CONREVSMA003.062  [CON-SMA-EDGE062]  (value not drawn)
OP1  THS4509  [RGT16]
OP2  THS4509  [RGT16]
R16  61R9 1% 0603  [RESC0603(1608)_M]
R17  49R9 1% 0603  [RESC0603(1608)_N]
R18  165R 1% 0603  [RESC0603(1608)_M]
R19  1K1 1% 0603  [RESC0603(1608)_N]
R20  15R 1% 0603  [RESC0603(1608)_M]
R21  165R 1% 0603  [RESC0603(1608)_M]
R22  15R 1% 0603  [RESC0603(1608)_M]
R23  61R9 1% 0603  [RESC0603(1608)_M]
R24  348R 1% 0603  [RESC0603(1608)_N]
R25  15R 1% 0603  [RESC0603(1608)_M]
R26  61R9 1% 0603  [RESC0603(1608)_M]
R27  49R9 1% 0603  [RESC0603(1608)_N]
R28  15R 1% 0603  [RESC0603(1608)_M]
R29  165R 1% 0603  [RESC0603(1608)_M]
R30  1K1 1% 0603  [RESC0603(1608)_N]
R31  165R 1% 0603  [RESC0603(1608)_M]
R32  348R 1% 0603  [RESC0603(1608)_N]
R33  61R9 1% 0603  [RESC0603(1608)_M]
U16  HMC849  [CP_16_40]
U17  HMC849  [CP_16_40]

### Blocks framed on the sheet
Place within 2mm of supply pins: C78-C81 C83-C86
No ground plane under outputs: R24
Place within 2mm of supply pins: C95-C98 C102-C105
No ground plane under outputs: R32

### Ports
2V5_IN-OPAMP_ANA, 3V_ANA, -2V5_IN-OPAMP_ANA, DRS_1+ (out), DRS_1- (out), DRS_2+ (out), DRS_2- (out), SW1_EN (in), SW1_VCTL (in), SW2_EN (in), SW2_VCTL (in), TC_SINUS_1 (in), TC_SINUS_2 (in), V_CM

### Nets
GND: C78.2 C79.2 C80.2 C81.2 C82.2 C83.2 C84.2 C85.2 C86.2 C87.2 C93.1 C94.1 C95.2 C96.2 C97.2 C98.2 C99.1 C100.1 C101.1 C102.2 C103.2 C104.2 C105.2 C107.2 D1.1(A1) D1.5(K5) D2.1(A1) D2.5(K5) J2.2(GND) J2.3(GND) J2.4(GND) J2.5(GND) J3.2(GND) J3.3(GND) J3.4(GND) J3.5(GND) OP1.17(EPAD) OP1.V(VIA) OP2.17(EPAD) OP2.V(VIA) R16.2 R19.1 R23.1 R26.2 R30.1 R33.1 U16.4(N/C) U16.6(N/C) U16.7(N/C) U16.8(N/C) U16.10(GND) U16.11(GND) U16.13(N/C) U16.14(N/C) U16.15(N/C) U16.16(N/C) U16.17(EP(GND)) U17.4(N/C) U17.6(N/C) U17.7(N/C) U17.8(N/C) U17.10(GND) U17.11(GND) U17.13(N/C) U17.14(N/C) U17.15(N/C) U17.16(N/C) U17.17(EP(GND))
NetC78_1: C78.1 C79.1 C80.1 C81.1 C95.1 C96.1 C97.1 C98.1 OP1.5(VS+) OP1.6(VS+) OP1.7(VS+) OP1.8(VS+) OP2.5(VS+) OP2.6(VS+) OP2.7(VS+) OP2.8(VS+) ; port 2V5_IN-OPAMP_ANA
NetC82_1: C82.1 C100.2 U16.1(VDD) U17.1(VDD) ; port 3V_ANA
NetC83_1: C83.1 C84.1 C85.1 C86.1 C102.1 C103.1 C104.1 C105.1 OP1.13(VS-) OP1.14(VS-) OP1.15(VS-) OP1.16(VS-) OP2.13(VS-) OP2.14(VS-) OP2.15(VS-) OP2.16(VS-) ; port -2V5_IN-OPAMP_ANA
NetC87_1: C87.1 R17.2
NetC88_1: C88.1 J2.1(Signal)
NetC88_2: C88.2 D1.2(K2) D1.4(A4) R19.2 U16.12(RF2)
NetC89_1: C89.1 U16.3(RFC)
NetC89_2: C89.2 R21.1 R23.2
NetC90_1: C90.1 ; port TC_SINUS_1
NetC90_2: C90.2 U16.9(RF1)
NetC91_1: C91.1 R20.1
NetC91_2: C91.2 OP1.10(VOUT-)
NetC92_1: C92.1 R22.1
NetC92_2: C92.2 OP1.3(VOUT+) R24.2
NetC93_2: C93.2 C94.2 C99.2 C101.2 OP1.4(CM) OP1.9(CM) OP2.4(CM) OP2.9(CM) ; port V_CM
NetC106_1: C106.1 R25.1
NetC106_2: C106.2 OP2.10(VOUT-)
NetC107_1: C107.1 R27.2
NetC108_1: C108.1 R28.1
NetC108_2: C108.2 OP2.3(VOUT+) R32.2
NetC109_1: C109.1 J3.1(Signal)
NetC109_2: C109.2 D2.2(K2) D2.4(A4) R30.2 U17.12(RF2)
NetC110_1: C110.1 U17.3(RFC)
NetC110_2: C110.2 R31.1 R33.2
NetC111_1: C111.1 ; port TC_SINUS_2
NetC111_2: C111.2 U17.9(RF1)
NetOP1_2: OP1.2(VIN-) R21.2 R24.1
NetOP1_11: OP1.11(VIN+) R18.2
NetOP2_2: OP2.2(VIN-) R31.2 R32.1
NetOP2_11: OP2.11(VIN+) R29.2
NetR16_1: R16.1 R17.1 R18.1
NetR20_2: R20.2 ; port DRS_1-
NetR22_2: R22.2 ; port DRS_1+
NetR25_2: R25.2 ; port DRS_2+
NetR26_1: R26.1 R27.1 R29.1
NetR28_2: R28.2 ; port DRS_2-
NetU16_2: U16.2(VCTL) ; port SW1_VCTL
NetU16_5: U16.5(EN) ; port SW1_EN
NetU17_2: U17.2(VCTL) ; port SW2_VCTL
NetU17_5: U17.5(EN) ; port SW2_EN

Not connected (* = marked no-connect by the designer): D1 3(C3)* 6(C6)*; D2 3(C3)* 6(C6)*; OP1 1(NC)* 12(~{PD})*; OP2 1(NC)* 12(~{PD})*

### Notes on the sheet
- No ground plane under inputs
- (near R24) Short feedback path
- No vias
- (near R32) Short feedback path
- 475 Portola Plaza
- GAPS TOF
- Title
- igarcia91@g.ucla.edu
- Los Angeles, CA
- 310-825-0344
- Size:
- Date:
- Letter
- Number:
- Time:
- Sheet
- Revision:
- of
- andrew.peck@cern.ch
- spq@ucla.edu
- File:
- (in symbol HMC849ALP4CE) 50

### Library data of the parts
C78 C79 C83 C84 C95 C96 C104 C105 = CMP-1036-04915-1: CAP 10uF 6.3V ±10% 0805 (2012 Metric) Thickness 1.45mm SMD; Tolerance: Â±10%; Case-EIA: 0805; Case-Metric: 2012; Technology: SMT; Rated Voltage: 6.3 V; Value: 10uF; Max Thickness: 1.45 mm
C80 C81 C85 C86 C97 C98 C102 C103 = CMP-1035-02585-1: CAP 100nF 16V ±20% 0603 (1608 Metric) Thickness 1mm SMD; Case-EIA: 0603; Tolerance: Â±20%; Case-Metric: 1608; Technology: SMT; Rated Voltage: 16 V; Value: 100nF; Max Thickness: 1 mm
C82 C100 = CMP-1034-01236-1: CAP 100pF 16V ±5% 0402 (1005 Metric) Thickness 0.6mm SMD; Case-Metric: 1005; Case-EIA: 0402; Tolerance: Â±5%; Rated Voltage: 16 V; Technology: SMT; Value: 100pF; Max Thickness: 0.6 mm
C87 C91 C92 C106-C108 = CMP-1035-02644-1: CAP 220nF 16V ±10% 0603 (1608 Metric) Thickness 1mm SMD; Tolerance: Â±10%; Case-EIA: 0603; Case-Metric: 1608; Rated Voltage: 16 V; Max Thickness: 1 mm; Technology: SMT; Value: 220nF
C88-C90 C109-C111 = CMP-1035-02736-1: CAP 1uF 16V ±5% 0603 (1608 Metric) Thickness 1mm SMD; Case-Metric: 1608; Case-EIA: 0603; Tolerance: Â±5%; Technology: SMT; Max Thickness: 1 mm; Rated Voltage: 16 V; Value: 1uF
C93 C94 C99 C101 = CMP-1034-02070-1: CAP 100nF 16V ±20% 0402 (1005 Metric) Thickness 0.6mm SMD; Tolerance: Â±20%; Case-EIA: 0402; Case-Metric: 1005; Value: 100nF; Max Thickness: 0.6 mm; Technology: SMT; Rated Voltage: 16 V
D1 D2 = CMP-1176-00030-1: Silicon Switching Diode, SOT363, Reel, Green; Manufacturer: Infineon; VR (max): 80Â V; VBR (min): 85Â V; IF (max): 200Â mA; trr (max): 4Â ns; Green: TRUE; VF (max): 1.25Â V; Configuration: Quadruple; IR (max): 150Â nA; PackageReference: SOT363; Halogen-free: TRUE; ComponentLink3URL: http://www.infineon.com/dgdl/SOT363-Package_Overview.pdf?folderId=db3a30431936bc4b01195360bd8f3cdc&fileId=db3a30431936bc4b0119536b62bf3cf5; PartNumber: BAV99S; ComponentLink3Description: Package Specification; ComponentLink2URL: http://www.infineon.com/dgdl/bav99series.pdf?folderId=db3a30431400ef6801141b5844e103ea&fileId=db3a30431400ef6801141c1b237d042f; ComponentLink1Description: Manufacturer URL; ComponentLink2Description: Datasheet; ComponentLink1URL: http://www.infineon.com/; PackageDescription: 6-Pin Small Outline Transistor Package, 1.25 x 2 mm Body; Mounting Technology: Surface Mount
J2 J3 = CMP-0168-00046-1: PCB_Layout: Pads complies with manufacturer's recommendation.; DatasheetVersion: rev1.0, Jun-2006; PackageVersion: rev1.0, Jun-2006; PackageReference: CON-SMA-EDGE062
OP1 OP2 = THS4509RGTT: Imported; Vendor: Texas Instruments; Built_By: EMA_UL_Team; C: Copyright (C) 2015 Accelerated Designs. All rights reserved; Manufacturer_Part_Number: THS4509RGTT; RefDes: RefDes; Type: DEV; Value: Value
R16 R23 R26 R33 = CMP-1012-00374-1: 61R9 0.1W 1% 0603 (1608 Metric)  SMD; Case-Metric: 1608; Case-EIA: 0603; Value: 61.90 Ohm; Technology: SMT; Tolerance: 1 %; Power: 0.1 W
R17 R27 = CMP-1012-00363-1: 49R9 0.1W 1% 0603 (1608 Metric)  SMD; Case-Metric: 1608; Case-EIA: 0603; Value: 49.90 Ohm; Power: 0.1 W; Tolerance: 1 %; Technology: SMT
R18 R21 R29 R31 = CMP-1012-00420-1: 165R 0.1W 1% 0603 (1608 Metric)  SMD; Value: 165.00 Ohm; Case-EIA: 0603; Case-Metric: 1608; Tolerance: 1 %; Power: 0.1 W; Technology: SMT
R19 R30 = CMP-1012-00514-1: 1K1 0.1W 1% 0603 (1608 Metric)  SMD; Case-Metric: 1608; Case-EIA: 0603; Value: 1100.00 Ohm; Technology: SMT; Tolerance: 1 %; Power: 0.1 W
R20 R22 R25 R28 = CMP-1012-00302-1: 15R 0.1W 1% 0603 (1608 Metric)  SMD; Case-Metric: 1608; Case-EIA: 0603; Value: 15.00 Ohm; Technology: SMT; Tolerance: 1 %; Power: 0.1 W
R24 R32 = CMP-1012-00457-1: 348R 0.1W 1% 0603 (1608 Metric)  SMD; Case-EIA: 0603; Case-Metric: 1608; Value: 348.00 Ohm; Technology: SMT; Power: 0.1 W; Tolerance: 1 %
U16 U17 = HMC849ALP4CE: Imported; Vendor: Analog Devices Inc; Built_By: Analog Devices Imc.; Manufacturer_Part_Number: HMC849ALP4CE; RefDes: RefDes; Type: DEV; Value: Value

## Nets that join several sheets
+3.3V: DRS4-TOP (J1.2), 2V5_DIST (TP8.1 U10.2)
+4V: DRS4-TOP (J1.1), 3_3V_DIST (TP3.1 U4.2)
-3.3V: DRS4-TOP (J1.3), -2V5_DIST (TP10.1 U14.2)
GND: DRS4-TOP (J1.4 J1.5 J1.6), 3_3V_DIST (24 pins), 2V5_DIST (18 pins), -2V5_DIST (7 pins), TCA (53 pins), ANA_FE_1_2 (68 pins)
NetC6_2: 3_3V_DIST (C6.2 TP2.1 U2.4), TCA (19 pins)